# EAGLE schematic breadboard_power_supply (EAGLE 6.1)
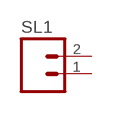
[diagram p0: schematic, sheet 1]

## Parts
SL1  M02  [02P]
Unconnected: SL1.1 SL1.2

## Library data of the parts
SL1 = con-amp-quick:M02: AMP QUICK CONNECTOR; OC_FARNELL: unknown; OC_NEWARK: unknown